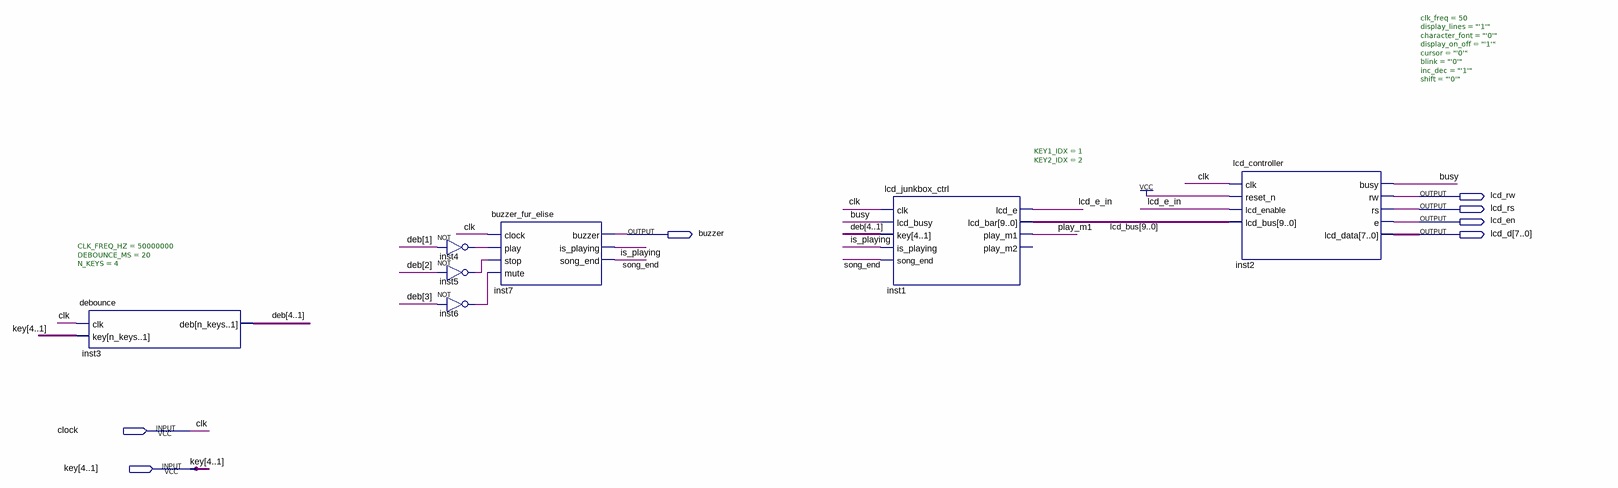
[diagram p0: schematic sheet]
// Quartus schematic Block1.bdf as structural Verilog: 7 symbols, 7 pins
module Block1 (
  input  clock,
  input  [4:1] key,
  output lcd_rw,
  output lcd_rs,
  output lcd_en,
  output buzzer,
  output [7:0] lcd_d
);

  wire busy, inst4_out, inst5_out, inst6_out, is_playing, lcd_e_in, play_m1, song_end;
  wire [4:1] deb;
  wire [9:0] lcd_bus;

  debounce #(.CLK_FREQ_HZ(50000000), .DEBOUNCE_MS(20), .N_KEYS(4)) inst3 (.clk(clock), .key(key), .deb(deb));
  not inst4 (inst4_out, deb[1]);
  not inst5 (inst5_out, deb[2]);
  not inst6 (inst6_out, deb[3]);
  buzzer_fur_elise inst7 (
    .clock(clock), .play(inst4_out), .stop(inst5_out), .mute(inst6_out), .buzzer(buzzer),
    .is_playing(is_playing), .song_end(song_end));
  lcd_junkbox_ctrl #(.KEY1_IDX(1), .KEY2_IDX(2)) inst1 (
    .clk(clock), .lcd_busy(busy), .key(deb), .is_playing(is_playing), .song_end(song_end), .lcd_e(lcd_e_in),
    .lcd_bar(lcd_bus), .play_m1(play_m1));  // open: play_m2
  lcd_controller #(.clk_freq(50), .display_lines("'1'"), .character_font("'0'"), .display_on_off("'1'"), .cursor("'0'"), .blink("'0'"), .inc_dec("'1'"), .shift("'0'")) inst2 (
    .clk(clock), .reset_n(1'b1), .lcd_enable(lcd_e_in), .lcd_bus(lcd_bus), .busy(busy), .rw(lcd_rw),
    .rs(lcd_rs), .e(lcd_en), .lcd_data(lcd_d));

  // Other names for the same wires on the sheet: clk = clock
endmodule
